# Altium schematic sheet CP2102.SchDoc
size A4
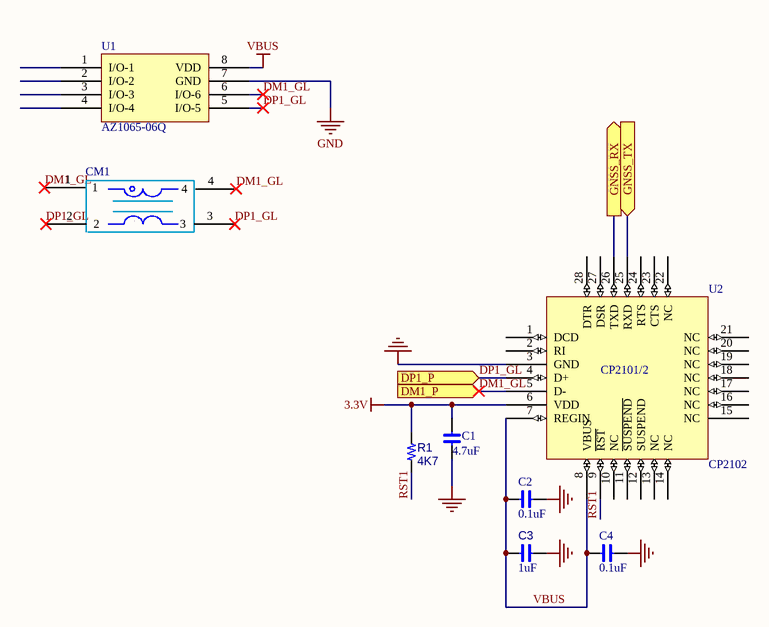
[diagram p0: CP2102.SchDoc]

## Parts
C1  C  [0603CAPC1608X09N]  (value not drawn)
C2  C  [0402CAPC1005X06N]  (value not drawn)
C3  15pF  [0402CAPC1005X06N]  (value not drawn)
C4  C  [0402CAPC1005X06N]  (value not drawn)
CM1  CM  [SMD_4P]  (value not drawn)
R1  4K7  [0402RESC1005X04N]
U1  AZ1065-06Q  [MSOP-8]
U2  CP2102  [QFN-28]

## Ports
DM1_P (in), DP1_P (in), GNSS_RX (out), GNSS_TX (in)

## Nets
3.3V: C1.2 R1.1 U2.6(VDD)
GND: C1.1 C2.1 C3.2 C4.1 U1.7(GND) U2.3(GND)
VBUS: C2.2 C3.1 C4.2 U1.8(VDD) U2.7(REGIN) U2.8(VBUS)
DM1_GL: CM1.1 CM1.4 U1.6(I/O-6) U2.5(D-) ; port DM1_P
DP1_GL: CM1.2 CM1.3 U1.5(I/O-5) U2.4(D+) ; port DP1_P
GNSS_RX: U2.26(TXD) ; port GNSS_RX
GNSS_TX: U2.25(RXD) ; port GNSS_TX
RST1: R1.2 U2.9(~{RST})

Not connected (* = marked no-connect by the designer): U1 1(I/O-1) 2(I/O-2) 3(I/O-3) 4(I/O-4); U2 1(DCD) 2(RI) 10(NC) 11(~{SUSPEND}) 12(SUSPEND) 13(NC) 14(NC) 15(NC) 16(NC) 17(NC) 18(NC) 19(NC) 20(NC) 21(NC) 22(NC) 23(CTS) 24(RTS) 27(DSR) 28(DTR)

## Notes on the sheet
- (in symbol C) 4.7uF; 0.1uF; 1uF

## Library data of the parts
C3 = C
CM1 = CM: USB Comon Choke
R1 = R
U2 = CP2101/2